# EAGLE design eprom-programmer (EAGLE 7.5.0)
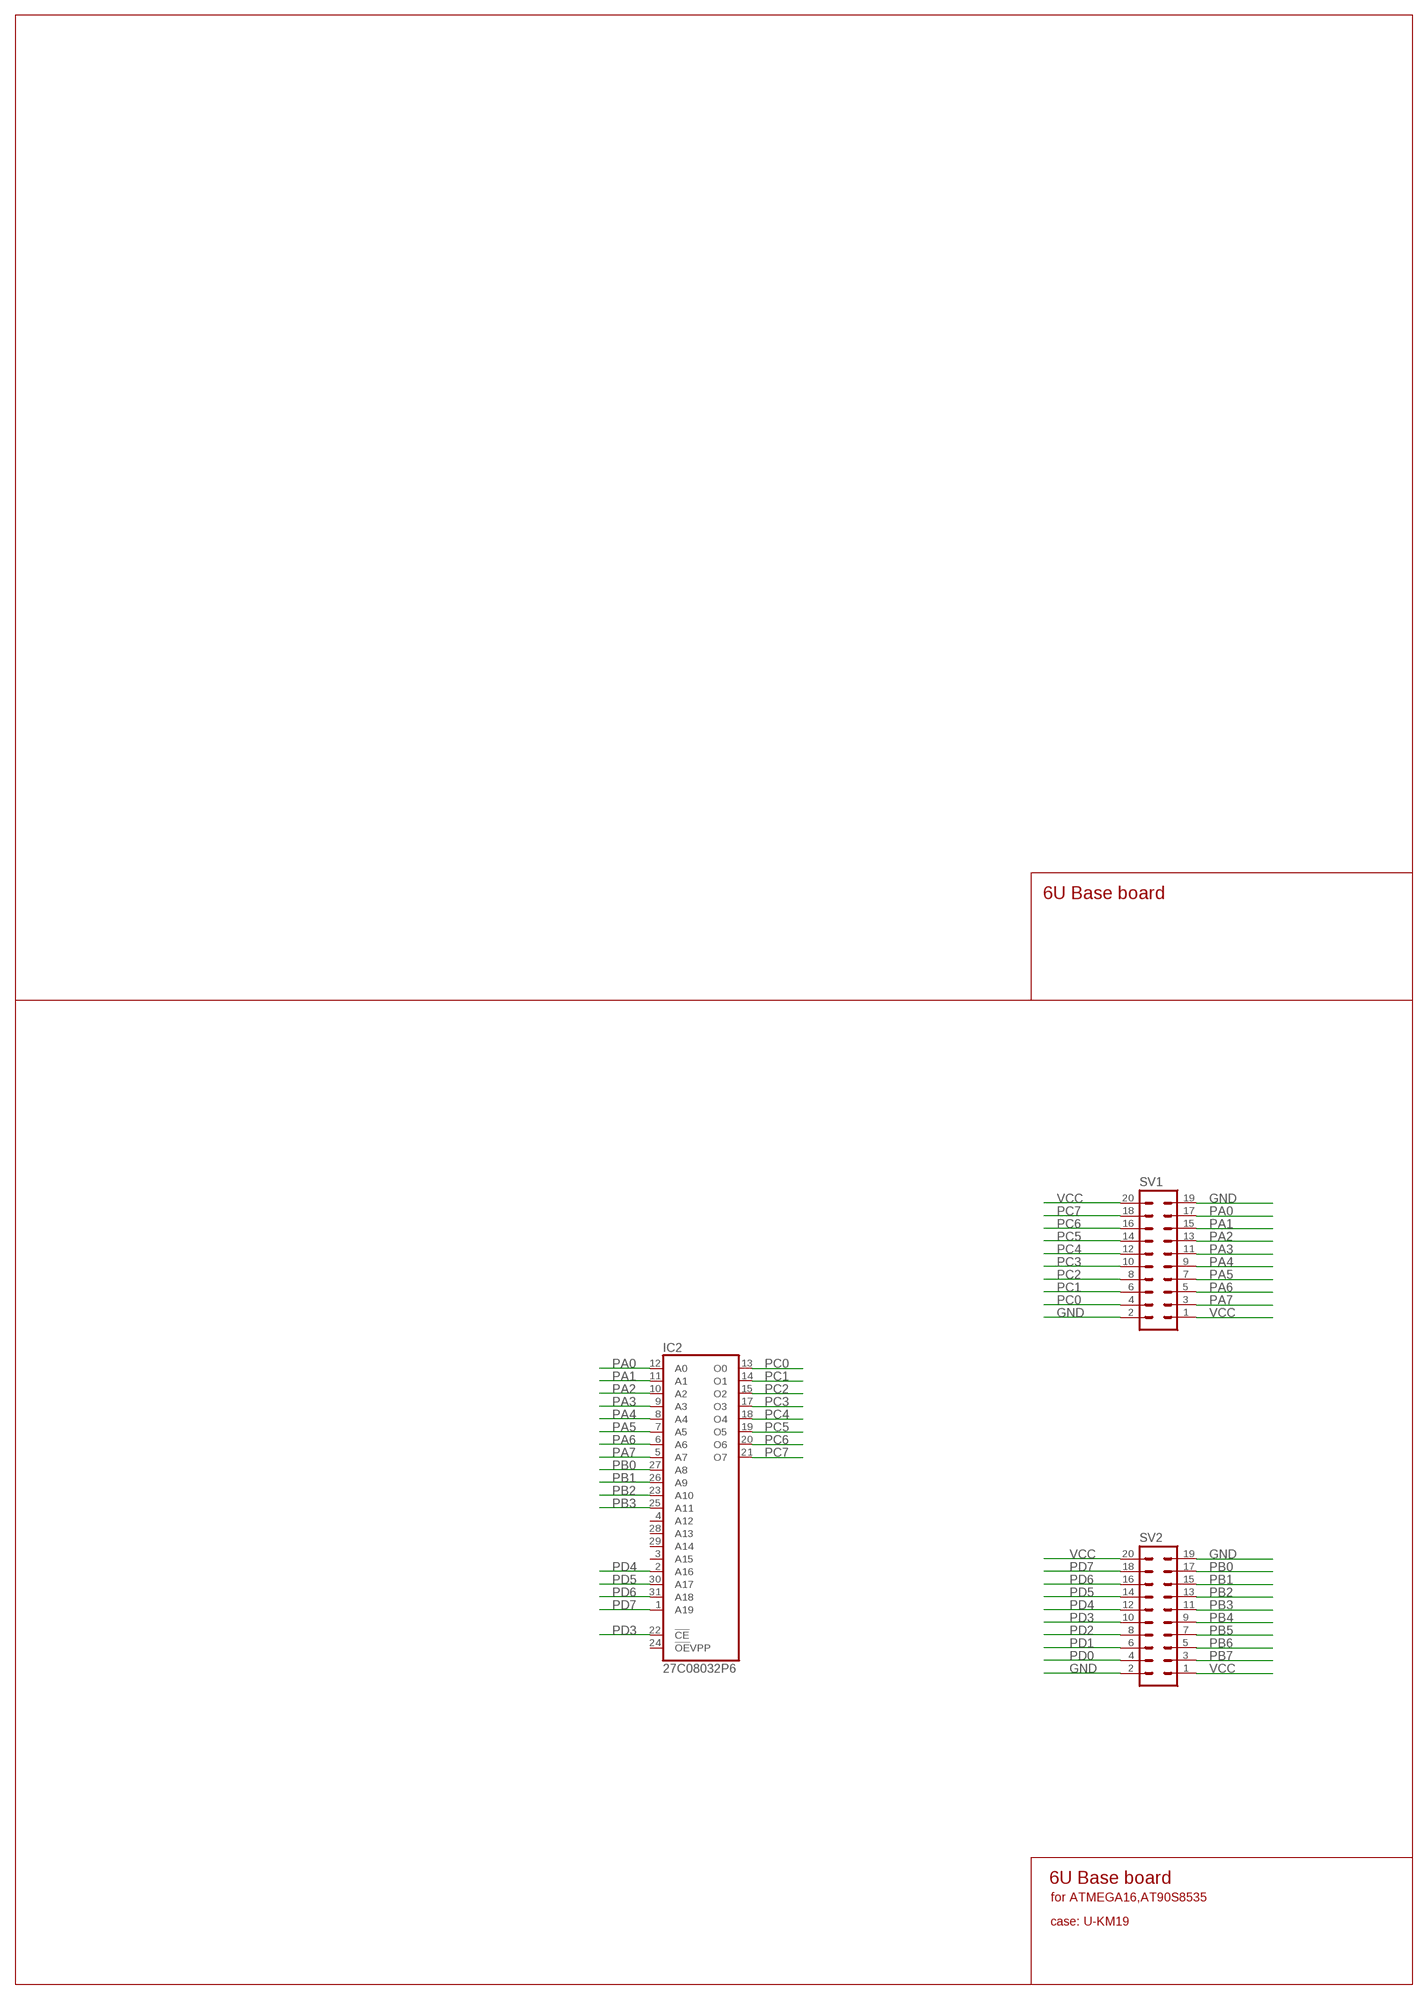
[diagram p0: schematic, sheet 1]

## Parts
IC2  27C08032P6  [DIL32]
SV1  MA10-2  [MA10-2]
SV2  MA10-2  [MA10-2]

## Nets
GND: SV1.2 SV1.19 SV2.2 SV2.19
PA0: IC2.12(A0) SV1.17
PA1: IC2.11(A1) SV1.15
PA2: IC2.10(A2) SV1.13
PA3: IC2.9(A3) SV1.11
PA4: IC2.8(A4) SV1.9
PA5: IC2.7(A5) SV1.7
PA6: IC2.6(A6) SV1.5
PA7: IC2.5(A7) SV1.3
PB0: IC2.27(A8) SV2.17
PB1: IC2.26(A9) SV2.15
PB2: IC2.23(A10) SV2.13
PB3: IC2.25(A11) SV2.11
PB4: SV2.9
PB5: SV2.7
PB6: SV2.5
PB7: SV2.3
PC0: IC2.13(O0) SV1.4
PC1: IC2.14(O1) SV1.6
PC2: IC2.15(O2) SV1.8
PC3: IC2.17(O3) SV1.10
PC4: IC2.18(O4) SV1.12
PC5: IC2.19(O5) SV1.14
PC6: IC2.20(O6) SV1.16
PC7: IC2.21(O7) SV1.18
PD0: SV2.4
PD1: SV2.6
PD2: SV2.8
PD3: IC2.22(!CE) SV2.10
PD4: IC2.2(A16) SV2.12
PD5: IC2.30(A17) SV2.14
PD6: IC2.31(A18) SV2.16
PD7: IC2.1(A19) SV2.18
VCC: SV1.1 SV1.20 SV2.1 SV2.20
Unconnected: IC2.3(A15) IC2.4(A12) IC2.24(!OE!VPP) IC2.28(A13) IC2.29(A14)

## Notes on the sheet
- 6U Base board
- 6U Base board
- for ATMEGA16,AT90S8535
- case: U-KM19

## Power pins joined to a net without a drawn wire
GND: IC2.16(GND)
VCC: IC2.32(VCC)

## Library data of the parts
IC2 = atmel:27C080: 8-Megabit (1Mx8) OTP EPROM; MPN: AT27C080-90PU; OC_FARNELL: 1455026; OC_NEWARK: 58M3824
SV1 SV2 = con-lstb:MA10-2: PIN HEADER; OC_FARNELL: unknown; OC_NEWARK: unknown

## Board
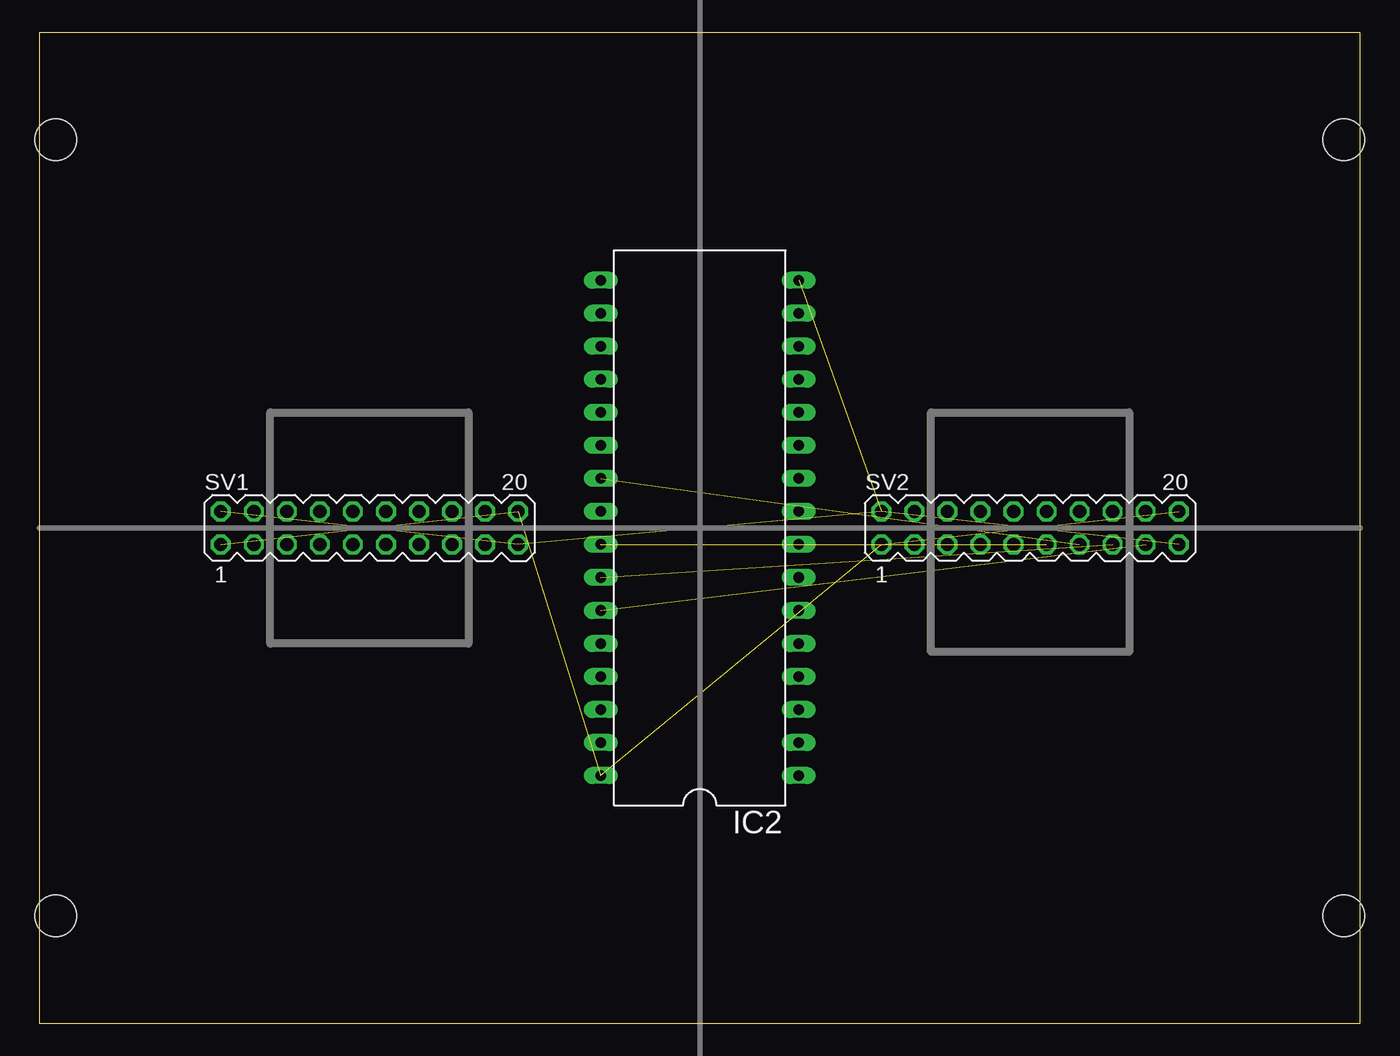
[diagram p1: board, top side]
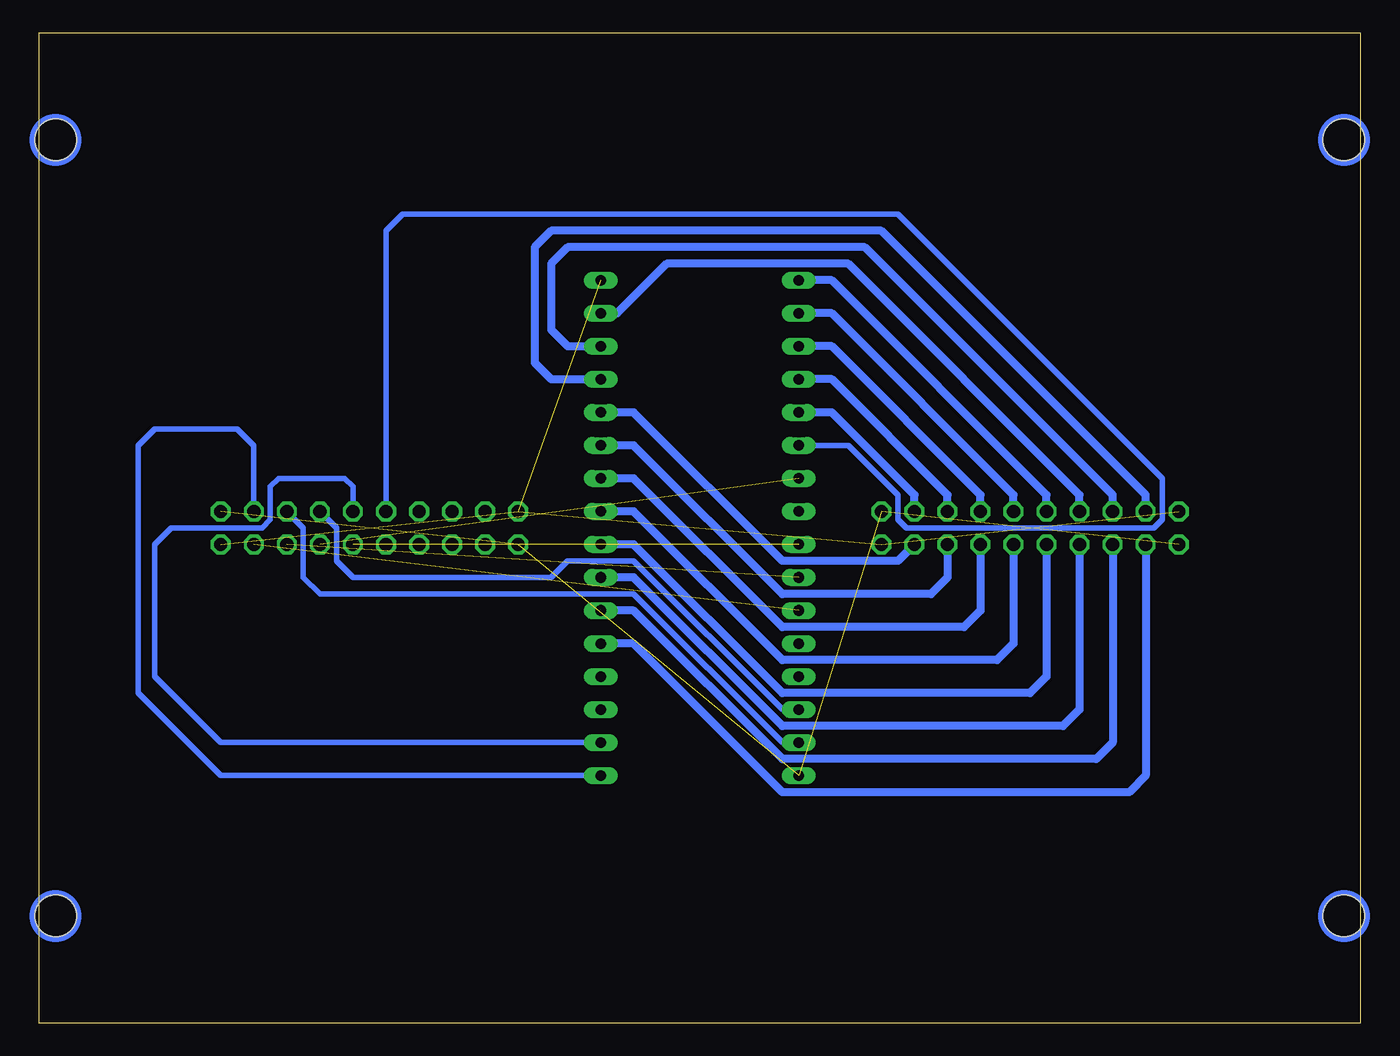
[diagram p2: board, bottom side, seen from below]

Size 101.6 x 76.2 mm. Coordinates in mm from the lower left corner, seen from the top.
Outline: 0,0 101.6,0 101.6,76.2 0,76.2 0,0
Copper layers (1*16): Top 0.035mm / dielectric 1.5mm / Bottom 0.035mm
Design rules "default": minimum track width 10mil, minimum drill 24mil, track to track 8mil, track to pad 8mil, pad to pad 8mil, via to via 8mil, smd to smd 8mil, copper to edge 40mil, drill to drill 8mil, minimum pad ring 10mil, minimum via ring 8mil, stop-mask expansion 4mil, vias tented up to drill 0mil, thermal gap 10mil
Holes 3.2 mm at 1.27,8.25 1.27,67.94 100.33,8.25 100.33,67.94
bRestrict: area -2.5,4.4 to 5.1,12.1; area 96.5,4.4 to 104.1,12.1; area -2.5,64.1 to 5.1,71.8; area 96.5,64.1 to 104.1,71.8

### Footprints (pad centres in the part's own frame; a part is rotated, then mirrored left to right if it is on the bottom)
DIL32 = drill 0.813 long: 1 -19.05,-7.62; 2 -16.51,-7.62; 3 -13.97,-7.62; 4 -11.43,-7.62; 5 -8.89,-7.62; 6 -6.35,-7.62; 7 -3.81,-7.62; 8 -1.27,-7.62; 9 1.27,-7.62; 10 3.81,-7.62; 11 6.35,-7.62; 12 8.89,-7.62; 13 11.43,-7.62; 14 13.97,-7.62; 15 16.51,-7.62; 16 19.05,-7.62; 17 19.05,7.62; 18 16.51,7.62; 19 13.97,7.62; 20 11.43,7.62; 21 8.89,7.62; 22 6.35,7.62; 23 3.81,7.62; 24 1.27,7.62; 25 -1.27,7.62; 26 -3.81,7.62; 27 -6.35,7.62; 28 -8.89,7.62; 29 -11.43,7.62; 30 -13.97,7.62; 31 -16.51,7.62; 32 -19.05,7.62
MA10-2 = drill 1.016 octagon: 1 -11.43,-1.27; 2 -11.43,1.27; 3 -8.89,-1.27; 4 -8.89,1.27; 5 -6.35,-1.27; 6 -6.35,1.27; 7 -3.81,-1.27; 8 -3.81,1.27; 9 -1.27,-1.27; 10 -1.27,1.27; 11 1.27,-1.27; 12 1.27,1.27; 13 3.81,-1.27; 14 3.81,1.27; 15 6.35,-1.27; 16 6.35,1.27; 17 8.89,-1.27; 18 8.89,1.27; 19 11.43,-1.27; 20 11.43,1.27

### Placement (x,y rotation side)
IC2  50.8,38.1 90 top
SV1  25.4,38.1 0 top
SV2  76.2,38.1 0 top

### Tracks (layer width: path | path; a pad name or v marks a point on that pad's centre or on a via)
GND  (4 unrouted)
PA0
  Bottom 0.61: SV1.17 35.56,35.56 44.45,35.56 55.88,46.99 IC2.12
PA1
  Bottom 0.61: SV1.15 31.75,34.29 33.02,33.02 44.45,33.02 55.88,44.45 IC2.11
PA2
  Bottom 0.61: SV1.13 29.21,31.75 30.48,30.48 44.45,30.48 55.88,41.91 IC2.10
PA3
  Bottom 0.61: SV1.11 26.67,29.21 27.94,27.94 44.45,27.94 55.88,39.37 IC2.9
PA4
  Bottom 0.61: SV1.9 24.13,26.67 25.4,25.4 44.45,25.4 55.88,36.83 IC2.8
PA5
  Bottom 0.61: SV1.7 21.59,24.13 22.86,22.86 44.45,22.86 55.88,34.29 IC2.7
PA6
  Bottom 0.61: SV1.5 19.05,21.59 20.32,20.32 44.45,20.32 55.88,31.75 IC2.6
PA7
  Bottom 0.61: SV1.3 16.51,19.05 17.78,17.78 44.45,17.78 55.88,29.21 IC2.5
PB0  (1 unrouted)
PB1  (1 unrouted)
PB2  (1 unrouted)
PB3  (1 unrouted)
PC0
  Bottom 0.61: SV1.4 16.51,40.64 36.83,60.96 62.23,60.96 63.5,59.69 63.5,50.8 62.23,49.53 IC2.13
PC1
  Bottom 0.61: SV1.6 19.05,40.64 38.1,59.69 60.96,59.69 62.23,58.42 62.23,53.34 60.96,52.07 IC2.14
PC2
  Bottom 0.61: SV1.8 21.59,40.64 39.37,58.42 53.34,58.42 57.15,54.61 IC2.15
PC3
  Bottom 0.61: SV1.10 24.13,40.64 40.64,57.15 IC2.17
PC4
  Bottom 0.61: SV1.12 26.67,40.64 40.64,54.61 IC2.18
PC5
  Bottom 0.61: SV1.14 29.21,40.64 40.64,52.07 IC2.19
PC6
  Bottom 0.61: SV1.16 31.75,40.64 40.64,49.53 IC2.20
PC7
  Bottom 0.61: SV1.18 34.29,40.64 40.64,46.99 IC2.21
PD3
  Bottom 0.406: IC2.22 39.37,44.45 35.56,40.64 35.56,38.73 34.92,38.1 15.88,38.1 15.24,38.73 15.24,41.91 35.56,62.23 73.66,62.23 74.93,60.96 SV2.10
PD4
  Bottom 0.406: IC2.2 87.63,21.59 92.71,26.67 92.71,36.83 91.44,38.1 84.45,38.1 83.82,38.73 83.82,41.27 83.19,41.91 78.11,41.91 77.47,41.27 SV2.12
PD5
  Bottom 0.406: IC2.30 44.45,24.13 55.88,35.56 60.96,35.56 62.23,34.29 77.47,34.29 78.74,35.56 78.74,38.1 SV2.14
PD6
  Bottom 0.406: IC2.31 44.45,21.59 55.88,33.02 80.01,33.02 81.28,34.29 81.28,38.1 SV2.16
PD7
  Bottom 0.406: IC2.1 87.63,19.05 93.98,25.4 93.98,44.45 92.71,45.72 86.36,45.72 85.09,44.45 SV2.18
VCC  (4 unrouted)
(copper drawn outside any net)
  shapes: Bottom circle x4